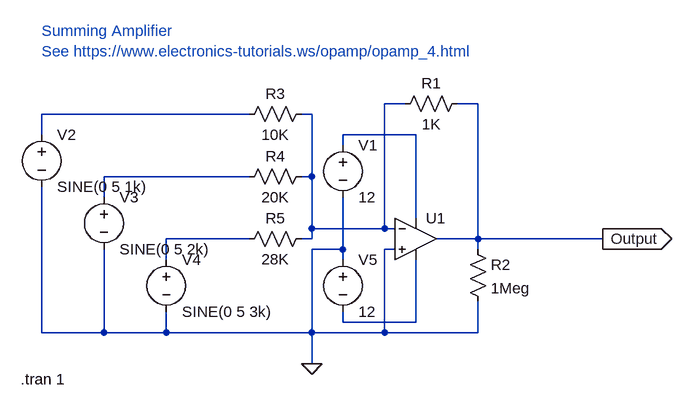
[diagram p0: schematic sumopamp.asc]
sumopamp.asc, the LTspice schematic file:
Version 4
SHEET 1 880 680
WIRE 224 -16 192 -16
WIRE 336 -16 304 -16
WIRE -16 0 -336 0
WIRE 80 0 64 0
WIRE -336 32 -336 0
WIRE 240 32 128 32
WIRE 128 48 128 32
WIRE -16 96 -240 96
WIRE 80 96 80 0
WIRE 80 96 64 96
WIRE -240 128 -240 96
WIRE 240 160 240 32
WIRE 80 176 80 96
WIRE 192 176 192 -16
WIRE 192 176 80 176
WIRE 208 176 192 176
WIRE -16 192 -144 192
WIRE 80 192 80 176
WIRE 80 192 64 192
WIRE 336 192 336 -16
WIRE 336 192 272 192
WIRE 528 192 336 192
WIRE 128 208 128 128
WIRE 128 208 80 208
WIRE 208 208 192 208
WIRE 336 208 336 192
WIRE -144 224 -144 192
WIRE 128 224 128 208
WIRE 128 320 128 304
WIRE 240 320 240 224
WIRE 240 320 128 320
WIRE -336 336 -336 112
WIRE -240 336 -240 208
WIRE -240 336 -336 336
WIRE -144 336 -144 304
WIRE -144 336 -240 336
WIRE 80 336 80 208
WIRE 80 336 -144 336
WIRE 192 336 192 208
WIRE 192 336 80 336
WIRE 336 336 336 288
WIRE 336 336 192 336
WIRE 80 384 80 336
FLAG 80 384 0
FLAG 528 192 Output
IOPIN 528 192 Out
SYMBOL OpAmps\\UniversalOpAmp 240 192 R0
SYMATTR InstName U1
SYMBOL res 320 -32 R90
WINDOW 0 0 56 VBottom 2
WINDOW 3 32 56 VTop 2
SYMATTR InstName R1
SYMATTR Value 1K
SYMATTR SpiceLine tol=1 pwr=0.1
SYMBOL res 320 192 R0
SYMATTR InstName R2
SYMATTR Value 1Meg
SYMATTR SpiceLine tol=1 pwr=0.1
SYMBOL res 80 -16 R90
WINDOW 0 0 56 VBottom 2
WINDOW 3 32 56 VTop 2
SYMATTR InstName R3
SYMATTR Value 10K
SYMATTR SpiceLine tol=1 pwr=0.1
SYMBOL res 80 80 R90
WINDOW 0 0 56 VBottom 2
WINDOW 3 32 56 VTop 2
SYMATTR InstName R4
SYMATTR Value 20K
SYMATTR SpiceLine tol=1 pwr=0.1
SYMBOL res 80 176 R90
WINDOW 0 0 56 VBottom 2
WINDOW 3 32 56 VTop 2
SYMATTR InstName R5
SYMATTR Value 28K
SYMATTR SpiceLine tol=1 pwr=0.1
SYMBOL voltage 128 32 R0
WINDOW 123 0 0 Left 0
WINDOW 39 0 0 Left 0
SYMATTR InstName V1
SYMATTR Value 12
SYMBOL voltage -336 16 R0
WINDOW 123 0 0 Left 0
WINDOW 39 0 0 Left 0
SYMATTR InstName V2
SYMATTR Value SINE(0 5 1k)
SYMBOL voltage -240 112 R0
WINDOW 123 0 0 Left 0
WINDOW 39 0 0 Left 0
SYMATTR InstName V3
SYMATTR Value SINE(0 5 2k)
SYMBOL voltage -144 208 R0
WINDOW 123 0 0 Left 0
WINDOW 39 0 0 Left 0
SYMATTR InstName V4
SYMATTR Value SINE(0 5 3k)
SYMBOL voltage 128 208 R0
WINDOW 123 0 0 Left 0
WINDOW 39 0 0 Left 0
SYMATTR InstName V5
SYMATTR Value 12
TEXT -368 408 Left 2 !.tran 1
TEXT -336 -128 Left 2 ;Summing Amplifier\nSee https://www.electronics-tutorials.ws/opamp/opamp_4.html

The netlist it stands for:
* sumopamp.asc
XU1 0 N001 N003 N006 Output level1 Avol=1Meg GBW=10Meg Vos=0 En=0 Enk=0 In=0 Ink=0 Rin=500Meg  ; pins In+ In- V+ V- OUT
R1 Output N001 1K tol=1 pwr=0.1
R2 Output 0 1Meg tol=1 pwr=0.1
R3 N001 N002 10K tol=1 pwr=0.1
R4 N001 N004 20K tol=1 pwr=0.1
R5 N001 N005 28K tol=1 pwr=0.1
V1 N003 0 12
V2 N002 0 SINE(0 5 1k)
V3 N004 0 SINE(0 5 2k)
V4 N005 0 SINE(0 5 3k)
V5 0 N006 12
.tran 1
* Summing Amplifier
* See https://www.electronics-tutorials.ws/opamp/opamp_4.html
.lib UniversalOpAmp1.lib
.backanno
.end